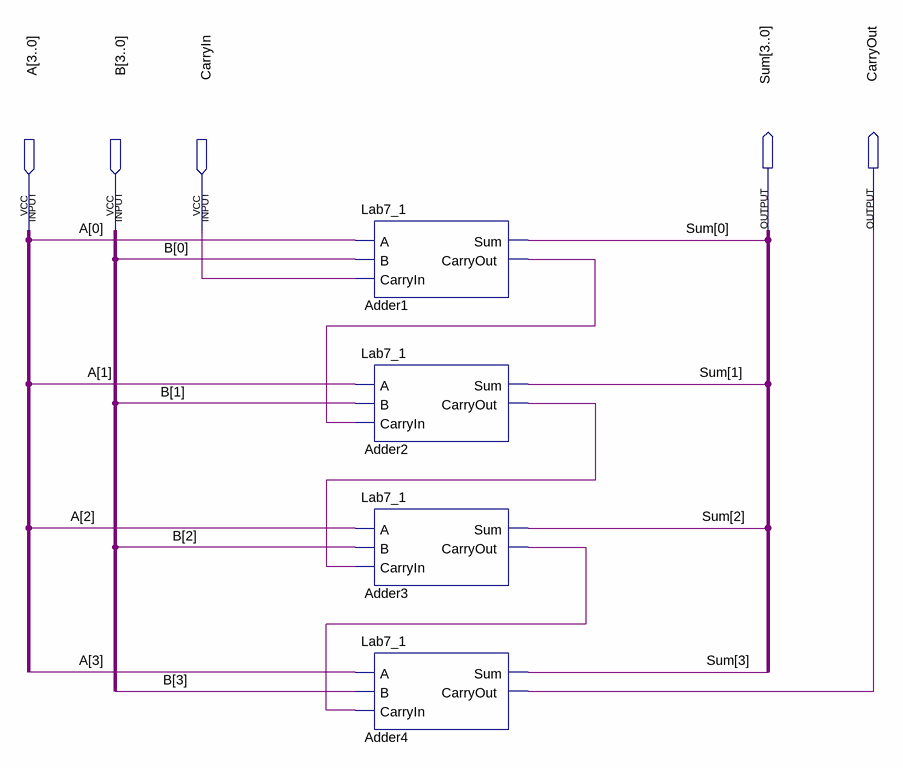
[diagram p0: schematic sheet]
// Quartus schematic Lab7_4.bdf as structural Verilog: 4 symbols, 5 pins
module Lab7_4 (
  input  [3:0] A,
  input  [3:0] B,
  input  CarryIn,
  output [3:0] Sum,
  output CarryOut
);

  wire Adder1_carryout, Adder2_carryout, Adder3_carryout;

  Lab7_1 Adder1 (.A(A[0]), .B(B[0]), .CarryIn(CarryIn), .Sum(Sum[0]), .CarryOut(Adder1_carryout));
  Lab7_1 Adder2 (.A(A[1]), .B(B[1]), .CarryIn(Adder1_carryout), .Sum(Sum[1]), .CarryOut(Adder2_carryout));
  Lab7_1 Adder3 (.A(A[2]), .B(B[2]), .CarryIn(Adder2_carryout), .Sum(Sum[2]), .CarryOut(Adder3_carryout));
  Lab7_1 Adder4 (.A(A[3]), .B(B[3]), .CarryIn(Adder3_carryout), .Sum(Sum[3]), .CarryOut(CarryOut));
endmodule
